# EAGLE design sw2 (EAGLE 8.6.3)
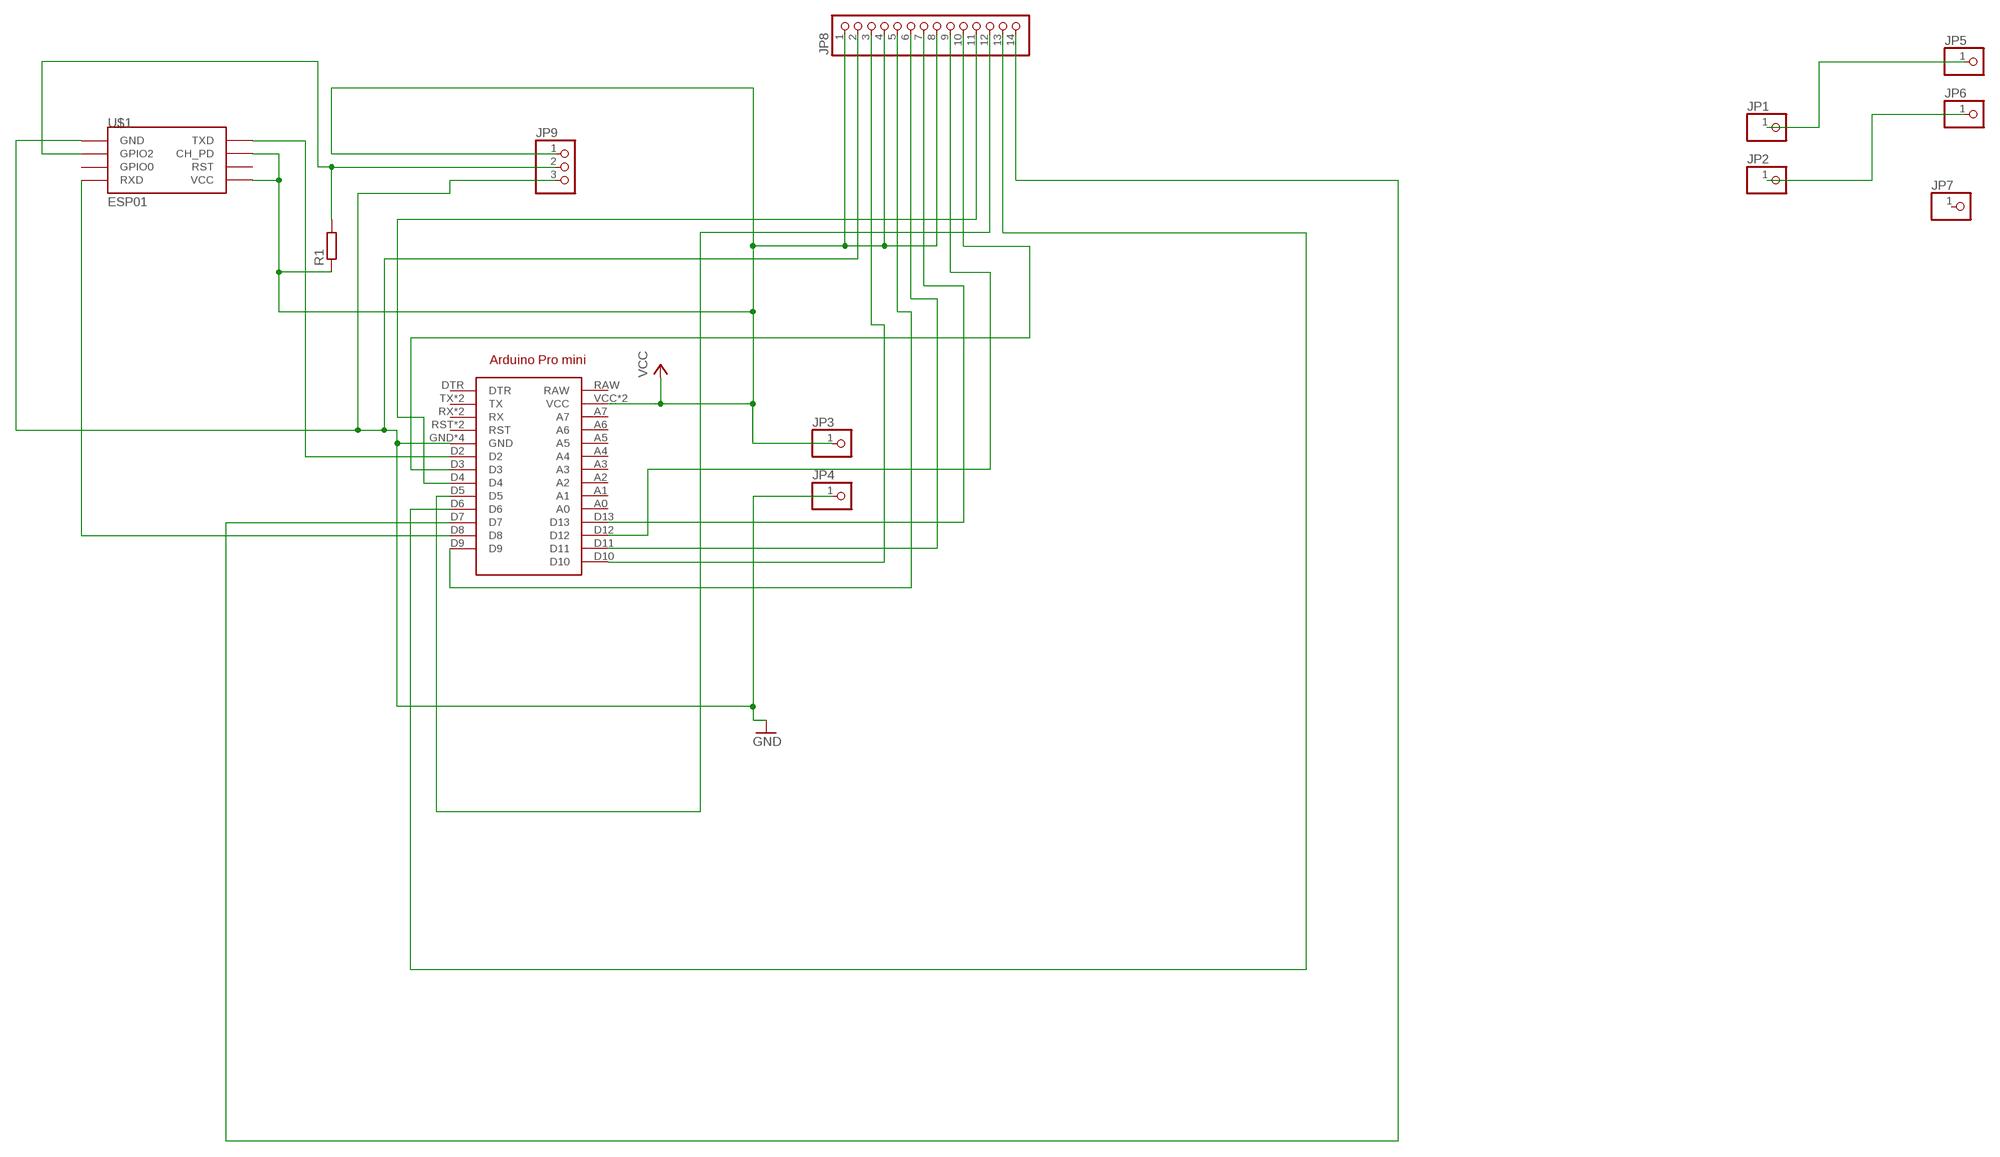
[diagram p0: schematic, sheet 1]

## Parts
ARDUINO1  ARDUINO_PRO_MINI  [ARDUINO_PRO_MINI]
JP1  PINHD-1X1  [1X01]
JP2  PINHD-1X1  [1X01]
JP3  PINHD-1X1  [1X01]
JP4  PINHD-1X1  [1X01]
JP5  PINHD-1X1  [1X01]
JP6  PINHD-1X1  [1X01]
JP7  PINHD-1X1  [1X01]
JP8  PINHD-1X14-CB  [1X14-CB]
JP9  PINHD-1X3  [1X03]
R1  R-EU_0204/5  [0204/5]
U$1  ESP01  [ESP01]

## Nets
GND: ARDUINO1.GND ARDUINO1.GND@1(GND) ARDUINO1.GND@2(GND) ARDUINO1.GND@3(GND) JP4.1 JP8.2 JP9.3 U$1.GND
N$1: JP1.1 JP5.1
N$2: JP2.1 JP6.1
N$3: ARDUINO1.D2 U$1.TX(TXD)
N$5: ARDUINO1.D10 JP8.3
N$6: JP9.2 R1.2 U$1.GPIO2
N$7: ARDUINO1.D13 JP8.7
N$8: ARDUINO1.D9 JP8.5
N$10: ARDUINO1.D8 U$1.RX(RXD)
N$11: ARDUINO1.D11 JP8.6
N$12: ARDUINO1.D12 JP8.9
N$13: ARDUINO1.D3 JP8.10
N$14: ARDUINO1.D4 JP8.11
N$15: ARDUINO1.D5 JP8.12
N$16: ARDUINO1.D6 JP8.13
N$17: ARDUINO1.D7 JP8.14
VCC: ARDUINO1.VCC ARDUINO1.VCC@1(VCC) JP3.1 JP8.1 JP8.4 JP8.8 JP9.1 R1.1 U$1.CH_PD U$1.VCC
Unconnected: ARDUINO1.A0 ARDUINO1.A1 ARDUINO1.A2 ARDUINO1.A3 ARDUINO1.A4 ARDUINO1.A5 ARDUINO1.A6 ARDUINO1.A7 ARDUINO1.DTR ARDUINO1.RAW ARDUINO1.RST ARDUINO1.RST@1(RST) ARDUINO1.RX ARDUINO1.RX@1(RX) ARDUINO1.TX ARDUINO1.TX@1(TX) JP7.1 U$1.GPIO0 U$1.RST

## Library data of the parts
ARDUINO1 = arduinopromini:ARDUINO_PRO_MINI: For creating Arduino Pro Mini shields
JP1-JP7 = adafruit:PINHD-1X1: Pin header 1x1 for 0.1" spacing With round pins
JP8 = adafruit:PINHD-1X14: PIN HEADER
JP9 = adafruit:PINHD-1X3: PIN HEADER
R1 = resistor:R-EU_: RESISTOR, European symbol
U$1 = esp8266modules:ESP01: ESP8266 Wifi module 01

## Board
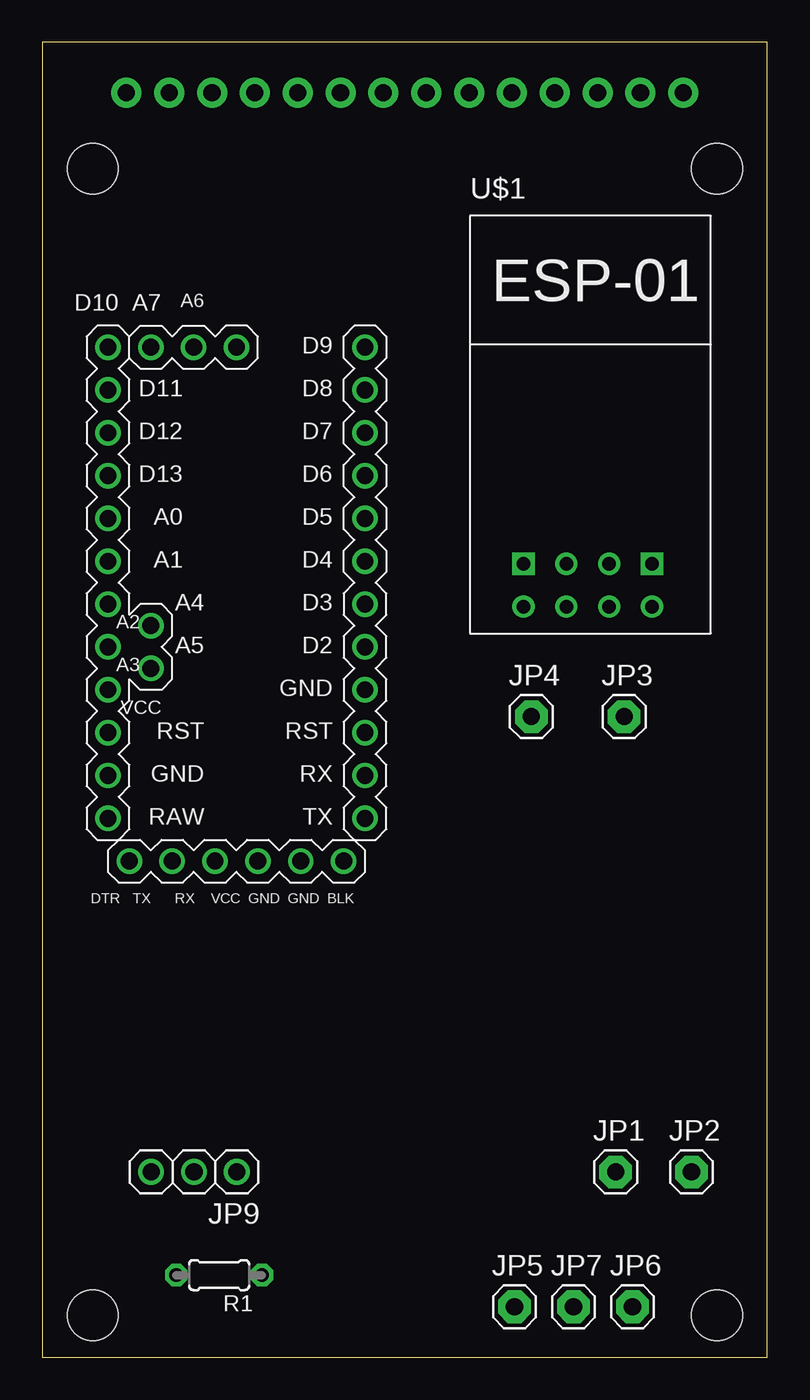
[diagram p1: board, top side]
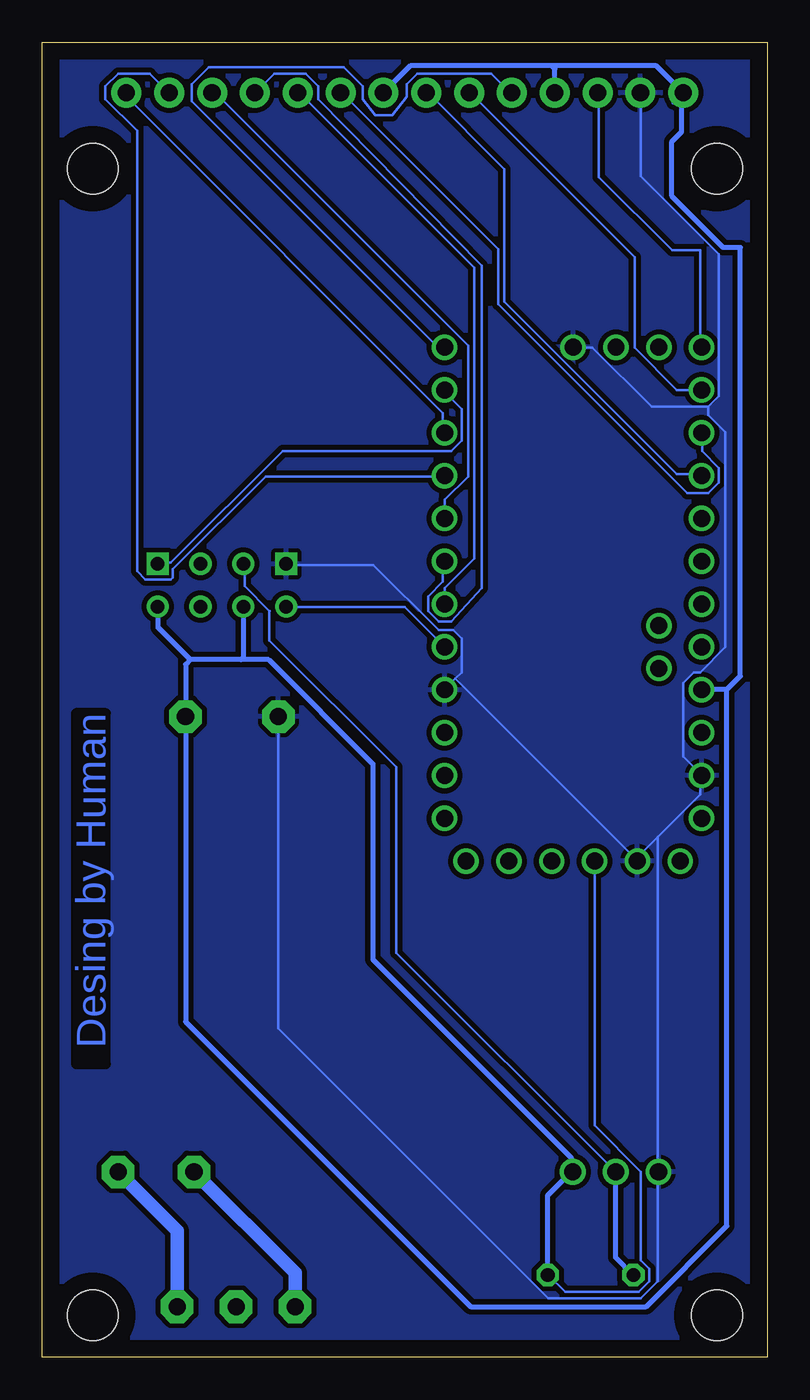
[diagram p2: board, bottom side, seen from below]

Size 43 x 78 mm. Coordinates in mm from the lower left corner, seen from the top.
Outline: 0,0 43,0 43,78 0,78 0,0
Copper layers (1*16): Top 0.035mm / dielectric 1.5mm / Bottom 0.035mm
Design rules "default": minimum track width 6mil, minimum drill 0.35mm, track to track 6mil, track to pad 6mil, pad to pad 6mil, via to via 6mil, smd to smd 6mil, copper to edge 40mil, drill to drill 6mil, minimum pad ring 10mil, minimum via ring 8mil, stop-mask expansion 4mil, vias tented up to drill 0mil, thermal gap 10mil
Holes 3 mm at 40,2.5 40,70.5 3,70.5 3,2.5

### Footprints (pad centres in the part's own frame; a part is rotated, then mirrored left to right if it is on the bottom)
ARDUINO_PRO_MINI = drill 1: A0 11.43,-8.89; A1 11.43,-6.35; A2 11.43,-3.81; A3 11.43,-1.27; A4 8.89,-2.54; A5 8.89,0; A6 6.35,-19.05; A7 8.89,-19.05; BLK 10.16,11.43; D2 -3.81,-1.27; D3 -3.81,-3.81; D4 -3.81,-6.35; D5 -3.81,-8.89; D6 -3.81,-11.43; D7 -3.81,-13.97; D8 -3.81,-16.51; D9 -3.81,-19.05; D10 11.43,-19.05; D11 11.43,-16.51; D12 11.43,-13.97; D13 11.43,-11.43; DTR -2.54,11.43; GND -3.81,1.27; GND@1 11.43,6.35; GND@2 7.62,11.43; GND@3 3.81,-19.05; RAW 11.43,8.89; RST 11.43,3.81; RST@1 -3.81,3.81; RX -3.81,6.35; RX@1 2.54,11.43; TX -3.81,8.89; TX@1 0,11.43; VCC 11.43,1.27; VCC@1 5.08,11.43
1X01 = drill 1.016 pad 1.93 octagon: 1 0,0
1X14-CB = drill 1.016 pad 1.778: 1 -16.51,0; 2 -13.97,0; 3 -11.43,0; 4 -8.89,0; 5 -6.35,0; 6 -3.81,0; 7 -1.27,0; 8 1.27,0; 9 3.81,0; 10 6.35,0; 11 8.89,0; 12 11.43,0; 13 13.97,0; 14 16.51,0
1X03 = drill 1.016: 1 -2.54,0; 2 0,0; 3 2.54,0
0204/5 = drill 0.813 octagon: 1 -2.54,0; 2 2.54,0
ESP01 = drill 0.8: CH_PD -1.285,-8.178; GPIO0 1.255,-5.638; GPIO2 -1.285,-5.638; RST 1.255,-8.178; TX -3.825,-8.178; VCC 3.795,-8.178 | drill 0.8 square: GND -3.825,-5.638; RX 3.795,-5.638

### Placement (x,y rotation side)
ARDUINO1  15.33,40.86 180 top
JP1  34,11 0 top
JP2  38.5,11 0 top
JP3  34.5,38 0 top
JP4  29,38 0 top
JP5  28,3 0 top
JP6  35,3 0 top
JP7  31.5,3 0 top
JP8  21.5,75 0 top
JP9  9,11 180 top
R1  10.49,4.88 180 top
U$1  32.36,52.7 0 top

### Tracks (layer width: path | path; a pad name or v marks a point on that pad's centre or on a via)
GND
  Bottom 0.152: 3.5,56.38 6.88,56.38 10.38,59.88 11.5,59.88 ARDUINO1.GND@3 | 3.5,56.38 2.88,57 2.88,65.42 7.5,70.05 7.5,75 JP8.2 | 18.5,40.25 19.12,39.62 ARDUINO1.GND | 18.5,40.25 18.12,40.62 18.12,42.62 18.62,43.12 19.5,43.12 23.38,47 28.5,47 U$1.GND | 6.5,30.88 7.62,29.75 7.62,29.5 ARDUINO1.GND@2 7.75,29.5 18.5,40.25 | 6.5,30.88 4,33.38 4,34.5 ARDUINO1.GND@1 4,34.62 5,35.62 5,40 4.38,40.62 4,40.62 2.5,42.12 2.5,54.88 3.5,55.88 3.5,56.38 | 6.5,30.88 6.5,11 | JP4.1 29,19.5 13,3.5 7.5,3.5 6.5,4.5 6.5,11 | 6.5,11 JP9.3
  pour Bottom (isolate 0.3): 0,78 43,78 43,0 0,0
N$1
  Bottom 0.813: JP5.1 28,5 JP1.1
N$2
  Bottom 0.813: JP6.1 35,7.5 JP2.1
N$3
  Bottom 0.152: U$1.TX 28.5,44.5 21.5,44.5 19.25,42.25 ARDUINO1.D2
N$5
  Bottom 0.152: ARDUINO1.D10 4,60 4,65.65 5.65,65.65 10,70 10,75 JP8.3
N$6
  Bottom 0.152: 29.5,44.25 29.52,44.27 | 29.52,44.27 31,45.75 31,47 U$1.GPIO2 | 8,5 R1.2 | JP9.2 22,24 22,35 29.52,42.52 29.52,44.27
  Bottom 0.305: R1.2 9,5.93 JP9.2
N$7
  Bottom 0.152: ARDUINO1.D13 4,52.38 5.38,52.38 15.6,62.6 15.6,70.47 20.12,75 JP8.7
N$8
  Bottom 0.152: ARDUINO1.D9 19.25,60 19.62,60 34.12,74.5 34.12,75.5 33.12,76.5 25.12,76.5 24,75.38 24,74.62 23.25,73.67 22.25,73.67 21.38,74.75 21.38,75.5 20.75,76.12 16.38,76.12 15.25,75 JP8.5
N$10
  Bottom 0.152: U$1.RX 36.12,47.12 35.38,47.12 28.75,53.75 18.75,53.75 18.12,54.38 18.12,56.25 19.12,57.25 ARDUINO1.D8
N$11
  Bottom 0.152: ARDUINO1.D11 4,57.38 5.38,57.38 7.88,59.88 7.88,65.25 17.62,75 JP8.6
N$12
  Bottom 0.152: ARDUINO1.D12 3.88,54.75 3.88,53.75 2.88,52.75 2.88,51.88 3.5,51.25 4.75,51.25 15.97,62.48 15.97,65.72 25.25,75 JP8.9
N$13
  Bottom 0.152: ARDUINO1.D3 19.12,44.75 19.12,45.62 17.38,47.38 17.38,64.62 27.75,75 JP8.10
N$14
  Bottom 0.152: ARDUINO1.D4 19.25,47.12 19.25,46 20.12,45.12 20.12,44.25 19.5,43.62 18.75,43.62 16.95,45.62 16.95,64.75 26.62,74.62 26.62,75.38 27.38,76.12 29.25,76.12 30.38,75 JP8.11
N$15
  Bottom 0.152: JP8.12 32.75,75 17.75,60 17.75,52.25 19.12,50.88 19.12,49.75 ARDUINO1.D5
N$16
  Bottom 0.152: ARDUINO1.D6 19.25,52.25 29.75,52.25 35.25,46.75 35.25,46.25 35.38,46.12 36.88,46.12 37.38,46.62 37.38,72.75 39.25,74.62 39.25,75.38 38.5,76.12 36.62,76.12 35.5,75 JP8.13
N$17
  Bottom 0.152: ARDUINO1.D7 19.25,54.88 19.25,56 38,74.75 JP8.14
VCC
  Bottom 0.152: 5.38,74.62 JP8.1 5.09,74.9 5.38,74.62 | 5.62,74.38 5.38,74.62 | 3.88,39.62 ARDUINO1.VCC 3.88,39.5 | 22.38,75 JP8.8 | 12.62,75 JP8.4 | 31.12,44.5 U$1.CH_PD | 36.12,44.5 U$1.VCC | 13,5 R1.1 13,4.88 12,3.88 7.62,3.88 7,4.5 7,5.25 7.5,5.75 7.5,11 10.25,13.75 ARDUINO1.VCC@1 | 11.62,11 JP9.1
  Bottom 0.305: JP8.1 6.59,76.6 12.8,76.6 | JP8.8 21.17,76.6 12.8,76.6 | JP8.4 12.61,76.41 12.8,76.6 | 2.4,39.6 2.4,7.8 7.2,3 17.6,3 34.5,19.9 JP3.1 34.5,41.1 34.23,41.38 | 2.4,39.6 ARDUINO1.VCC | 2.4,39.6 1.6,40.4 1.6,65.83 2.63,65.83 5.67,68.87 5.67,72.11 5.09,72.68 5.09,74.9 | R1.1 13.03,9.6 11.62,11 11.62,11.82 23.4,23.6 23.4,35.2 29.57,41.38 31.2,41.38 | 31.2,41.38 34.23,41.38 | 34.23,41.38 36.12,43.27 36.12,44.5 | U$1.CH_PD 31.07,41.5 31.2,41.38

### Text on the board
Bottom: Desing by Human